# Altium schematic sheet SAS_Connectors.SchDoc: FMC_ADC
size 420 x 297 mm; Author: G.Kasprowicz; CompanyName: WUT ISE; DrawnBy: G.Kasprowicz; Organization: WUT ISE; Address1: PW ISE; Address2: Nowowiejska 15/19 00-665 Warsaw; Address3: gkasprow@gmail.com; Revision: 2; SheetNumber: -; SheetTotal: -; ModifiedBy: -; CheckedDate: -; Title2: 100M_10B_16CHA_TDC; DivGrp: WUT ISE; Designer: G.Kasprowicz; ModifiedDate: -; ProjectName: Sensor Box
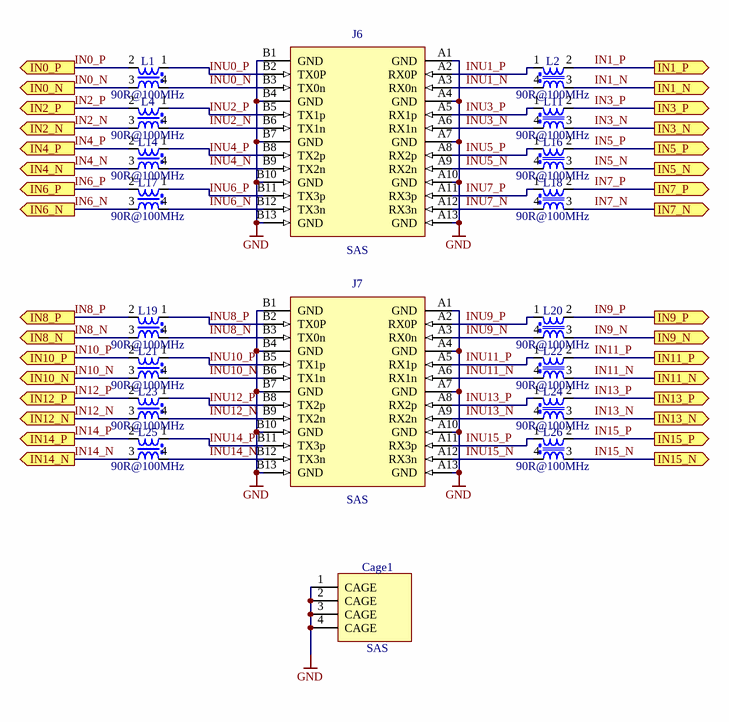
[diagram p0: SAS_Connectors.SchDoc]

## Parts
Cage1  SAS  [TYCO_1888321-2]
J6  SAS  [TYCO_1761987-7]
J7  SAS  [TYCO_1761987-7]
L1  90R@100MHz  [IND_MURATA_DLW21S]
L2  90R@100MHz  [IND_MURATA_DLW21S]
L4  90R@100MHz  [IND_MURATA_DLW21S]
L11  90R@100MHz  [IND_MURATA_DLW21S]
L14  90R@100MHz  [IND_MURATA_DLW21S]
L16  90R@100MHz  [IND_MURATA_DLW21S]
L17  90R@100MHz  [IND_MURATA_DLW21S]
L18  90R@100MHz  [IND_MURATA_DLW21S]
L19  90R@100MHz  [IND_MURATA_DLW21S]
L20  90R@100MHz  [IND_MURATA_DLW21S]
L21  90R@100MHz  [IND_MURATA_DLW21S]
L22  90R@100MHz  [IND_MURATA_DLW21S]
L23  90R@100MHz  [IND_MURATA_DLW21S]
L24  90R@100MHz  [IND_MURATA_DLW21S]
L25  90R@100MHz  [IND_MURATA_DLW21S]
L26  90R@100MHz  [IND_MURATA_DLW21S]

## Ports
IN0_N (out), IN0_P (out), IN1_N (out), IN1_P (out), IN2_N (out), IN2_P (out), IN3_N (out), IN3_P (out), IN4_N (out), IN4_P (out), IN5_N (out), IN5_P (out), IN6_N (out), IN6_P (out), IN7_N (out), IN7_P (out), IN8_N (out), IN8_P (out), IN9_N (out), IN9_P (out), IN10_N (out), IN10_P (out), IN11_N (out), IN11_P (out), IN12_N (out), IN12_P (out), IN13_N (out), IN13_P (out), IN14_N (out), IN14_P (out), IN15_N (out), IN15_P (out)

## Nets
GND: Cage1.1(CAGE) Cage1.2(CAGE) Cage1.3(CAGE) Cage1.4(CAGE) J6.A1(GND) J6.A4(GND) J6.A7(GND) J6.A10(GND) J6.A13(GND) J6.B1(GND) J6.B4(GND) J6.B7(GND) J6.B10(GND) J6.B13(GND) J7.A1(GND) J7.A4(GND) J7.A7(GND) J7.A10(GND) J7.A13(GND) J7.B1(GND) J7.B4(GND) J7.B7(GND) J7.B10(GND) J7.B13(GND)
IN0_N: L1.3 ; port IN0_N
IN0_P: L1.2 ; port IN0_P
IN1_N: L2.3 ; port IN1_N
IN1_P: L2.2 ; port IN1_P
IN2_N: L4.3 ; port IN2_N
IN2_P: L4.2 ; port IN2_P
IN3_N: L11.3 ; port IN3_N
IN3_P: L11.2 ; port IN3_P
IN4_N: L14.3 ; port IN4_N
IN4_P: L14.2 ; port IN4_P
IN5_N: L16.3 ; port IN5_N
IN5_P: L16.2 ; port IN5_P
IN6_N: L17.3 ; port IN6_N
IN6_P: L17.2 ; port IN6_P
IN7_N: L18.3 ; port IN7_N
IN7_P: L18.2 ; port IN7_P
IN8_N: L19.3 ; port IN8_N
IN8_P: L19.2 ; port IN8_P
IN9_N: L20.3 ; port IN9_N
IN9_P: L20.2 ; port IN9_P
IN10_N: L21.3 ; port IN10_N
IN10_P: L21.2 ; port IN10_P
IN11_N: L22.3 ; port IN11_N
IN11_P: L22.2 ; port IN11_P
IN12_N: L23.3 ; port IN12_N
IN12_P: L23.2 ; port IN12_P
IN13_N: L24.3 ; port IN13_N
IN13_P: L24.2 ; port IN13_P
IN14_N: L25.3 ; port IN14_N
IN14_P: L25.2 ; port IN14_P
IN15_N: L26.3 ; port IN15_N
IN15_P: L26.2 ; port IN15_P
INU0_N: J6.B3(TX0n) L1.4
INU0_P: J6.B2(TX0P) L1.1
INU1_N: J6.A3(RX0n) L2.4
INU1_P: J6.A2(RX0P) L2.1
INU2_N: J6.B6(TX1n) L4.4
INU2_P: J6.B5(TX1p) L4.1
INU3_N: J6.A6(RX1n) L11.4
INU3_P: J6.A5(RX1p) L11.1
INU4_N: J6.B9(TX2n) L14.4
INU4_P: J6.B8(TX2p) L14.1
INU5_N: J6.A9(RX2n) L16.4
INU5_P: J6.A8(RX2p) L16.1
INU6_N: J6.B12(TX3n) L17.4
INU6_P: J6.B11(TX3p) L17.1
INU7_N: J6.A12(RX3n) L18.4
INU7_P: J6.A11(RX3p) L18.1
INU8_N: J7.B3(TX0n) L19.4
INU8_P: J7.B2(TX0P) L19.1
INU9_N: J7.A3(RX0n) L20.4
INU9_P: J7.A2(RX0P) L20.1
INU10_N: J7.B6(TX1n) L21.4
INU10_P: J7.B5(TX1p) L21.1
INU11_N: J7.A6(RX1n) L22.4
INU11_P: J7.A5(RX1p) L22.1
INU12_N: J7.B9(TX2n) L23.4
INU12_P: J7.B8(TX2p) L23.1
INU13_N: J7.A9(RX2n) L24.4
INU13_P: J7.A8(RX2p) L24.1
INU14_N: J7.B12(TX3n) L25.4
INU14_P: J7.B11(TX3p) L25.1
INU15_N: J7.A12(RX3n) L26.4
INU15_P: J7.A11(RX3p) L26.1

## Notes on the sheet
- Project/Equipment
- Document
- Designer
- Drawn by
- Check.by
- Copyright WUT ISE 2018.
  This documentation describes Open Hardware and is licensed under the CERN OHL v.1.1. You may redistribute and modify this documentation under the terms of the CERN OHL v.1.1. (http://ohwr.org/CERNOHL). This documentation is distributed WITHOUT ANY EXPRESS OR IMPLIED WARRANTY, INCLUDING OF MERCHANTABILITY, SATISFACTORY QUALITY AND FITNESS FOR A PARTICULAR PURPOSE. Please see the CERN OHL v.1.1 for applicable conditions.
- Contact
- File
- Last Mod.
- Print Date
- Sheet
- Size
- A3
- of
- Rev

## Library data of the parts
Cage1 = CON_SAS_Cage: SAS 2x1 Cage; Part Description: 1x1 Press Fit Cage For Use with QSFP Connector (Quad Small Form-factor Pluggable); Manufacturer: TYCO ELECTRONICS; Manufacturer Part Number: 1888321-2; Part Number: TYCO_1888321-2; Component Kind: Standard; Component Type: Standard; Pin Count: 12; Family: SAS; Mounted: Yes; Socket: No; SMD: Yes; PressFit: Yes; Sense: No; Status: None; ComponentHeight: 9.7mm; HelpURL: \\cern.ch\dfs\Applications\Altium\Datasheets\TYCO_1888617-1.pdf; Author: GK; CreateDate: 04.03.2014; LatestRevisionDate: 04.03.2014
J6 J7 = CON_SAS_1761987-7: 26Position mini SAS Connector; Part Description: Surface Mount EVERCLEAR Mini-SAS Right Angle Host Connector; Manufacturer: TYCO ELECTRONICS; PressFit: No; Part Number: TYCO_1761987-7; Component Kind: Standard; Component Type: Standard; Footprint: TYCO_ 1761987-7; Pin Count: 38; Family: SAS; Mounted: Yes; Socket: No; SMD: No; Sense: No; Status: None; Manufacturer Part Number: 1761987-7; ComponentHeight: 5.55mm; HelpURL: \\cern.ch\dfs\Applications\Altium\Datasheets\TYCO_1761987-9.pdf; Author: GK; CreateDate: 15.07.2013; LatestRevisionDate: 15.07.2013
L1 L2 L4 L11 L14 L16-L26 = IND_MURATA_DLW21SN900SQ2L: Inductor Common Mode; Part Description: Wire Wound Common Mode Choke Coil (DLW21S Series); Manufacturer: MURATA; Power: 330mA; Resistance: 0.35R; Tolerance: ±25%; Part Number: IND_MURATA_DLW21SN900SQ2L; Component Kind: Standard; Component Type: Standard; Pin Count: 4; Value: 90R@100MHz; Status: None; Manufacturer Part Number: DLW21SN900SQ2L; Case: 0805; Mounted: Yes; Socket: No; SMD: Yes; Sense: No; ComponentHeight: 1.4mm; HelpURL: \\cern.ch\dfs\Applications\Altium\Datasheets\IND_MURATA_DLW21S.pdf; Author: CERN DEM JLC; CreateDate: 01.07.2014; LatestRevisionDate: 01.07.2014